# EAGLE schematic bms1 (EAGLE 9.6.2)
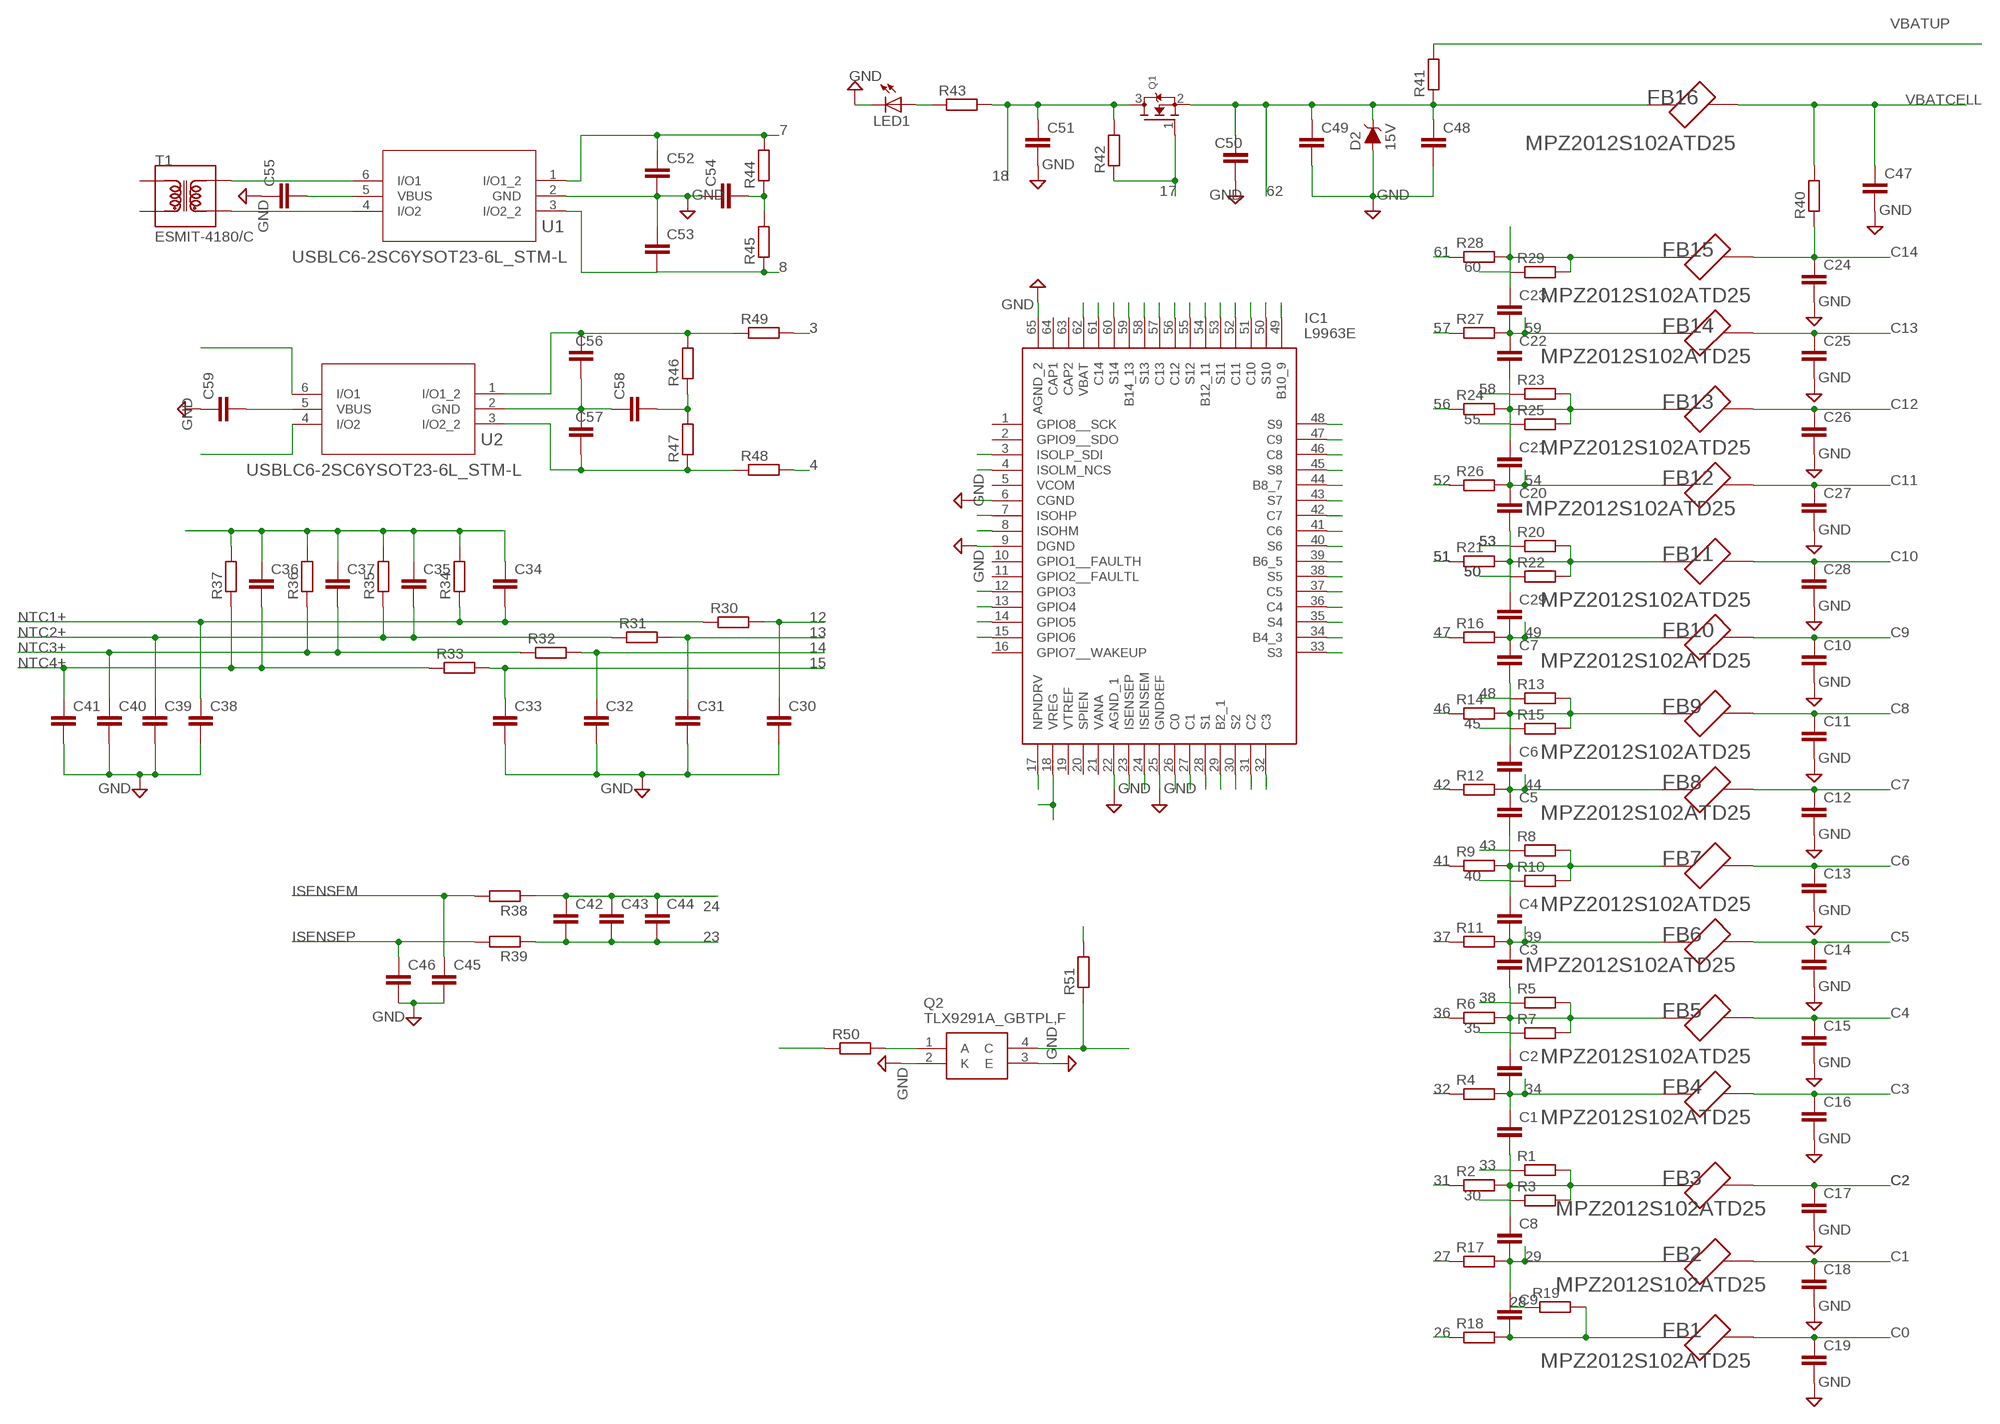
[diagram p0: schematic, sheet 1]

## Parts
C1  C-EUC0402K  [C0402K]
C2  C-EUC0402K  [C0402K]
C3  C-EUC0402K  [C0402K]
C4  C-EUC0402K  [C0402K]
C5  C-EUC0402K  [C0402K]
C6  C-EUC0402K  [C0402K]
C7  C-EUC0402K  [C0402K]
C8  C-EUC0402K  [C0402K]
C9  C-EUC0402K  [C0402K]
C10  C-EUC0402K  [C0402K]
C11  C-EUC0402K  [C0402K]
C12  C-EUC0402K  [C0402K]
C13  C-EUC0402K  [C0402K]
C14  C-EUC0402K  [C0402K]
C15  C-EUC0402K  [C0402K]
C16  C-EUC0402K  [C0402K]
C17  C-EUC0402K  [C0402K]
C18  C-EUC0402K  [C0402K]
C19  C-EUC0402K  [C0402K]
C20  C-EUC0402K  [C0402K]
C21  C-EUC0402K  [C0402K]
C22  C-EUC0402K  [C0402K]
C23  C-EUC0402K  [C0402K]
C24  C-EUC0402K  [C0402K]
C25  C-EUC0402K  [C0402K]
C26  C-EUC0402K  [C0402K]
C27  C-EUC0402K  [C0402K]
C28  C-EUC0402K  [C0402K]
C29  C-EUC0402K  [C0402K]
C30  C-EUC0402K  [C0402K]
C31  C-EUC0402K  [C0402K]
C32  C-EUC0402K  [C0402K]
C33  C-EUC0402K  [C0402K]
C34  C-EUC0402K  [C0402K]
C35  C-EUC0402K  [C0402K]
C36  C-EUC0402K  [C0402K]
C37  C-EUC0402K  [C0402K]
C38  C-EUC0402K  [C0402K]
C39  C-EUC0402K  [C0402K]
C40  C-EUC0402K  [C0402K]
C41  C-EUC0402K  [C0402K]
C42  C-EUC0402K  [C0402K]
C43  C-EUC0402K  [C0402K]
C44  C-EUC0402K  [C0402K]
C45  C-EUC0402K  [C0402K]
C46  C-EUC0402K  [C0402K]
C47  C-EUC0402K  [C0402K]
C48  C-EUC0402K  [C0402K]
C49  C-EUC0402K  [C0402K]
C50  C-EUC0402K  [C0402K]
C51  C-EUC0402K  [C0402K]
C52  C-EUC0402K  [C0402K]
C53  C-EUC0402K  [C0402K]
C54  C-EUC0402K  [C0402K]
C55  C-EUC0402K  [C0402K]
C56  C-EUC0402K  [C0402K]
C57  C-EUC0402K  [C0402K]
C58  C-EUC0402K  [C0402K]
C59  C-EUC0402K  [C0402K]
D2  15V  DIODE-ZENER-DZ2J150M0L  [PANASONIC_SMINI2-F5-B]
FB1  MPZ2012S102ATD25  [BEADC2012X105N]
FB2  MPZ2012S102ATD25  [BEADC2012X105N]
FB3  MPZ2012S102ATD25  [BEADC2012X105N]
FB4  MPZ2012S102ATD25  [BEADC2012X105N]
FB5  MPZ2012S102ATD25  [BEADC2012X105N]
FB6  MPZ2012S102ATD25  [BEADC2012X105N]
FB7  MPZ2012S102ATD25  [BEADC2012X105N]
FB8  MPZ2012S102ATD25  [BEADC2012X105N]
FB9  MPZ2012S102ATD25  [BEADC2012X105N]
FB10  MPZ2012S102ATD25  [BEADC2012X105N]
FB11  MPZ2012S102ATD25  [BEADC2012X105N]
FB12  MPZ2012S102ATD25  [BEADC2012X105N]
FB13  MPZ2012S102ATD25  [BEADC2012X105N]
FB14  MPZ2012S102ATD25  [BEADC2012X105N]
FB15  MPZ2012S102ATD25  [BEADC2012X105N]
FB16  MPZ2012S102ATD25  [BEADC2012X105N]
IC1  L9963E  [QFP50P1200X1200X120-65N]
LED1  LED  [SMARTLED-TTW]
Q1  MOSFET-NREFLOW  [SOT23]
Q2  TLX9291A_GBTPL,F  [SOIC127P700X230-4N]
R1  R-EU_R0603  [R0603]
R2  R-EU_R0603  [R0603]
R3  R-EU_R0603  [R0603]
R4  R-EU_R0603  [R0603]
R5  R-EU_R0603  [R0603]
R6  R-EU_R0603  [R0603]
R7  R-EU_R0603  [R0603]
R8  R-EU_R0603  [R0603]
R9  R-EU_R0603  [R0603]
R10  R-EU_R0603  [R0603]
R11  R-EU_R0603  [R0603]
R12  R-EU_R0603  [R0603]
R13  R-EU_R0603  [R0603]
R14  R-EU_R0603  [R0603]
R15  R-EU_R0603  [R0603]
R16  R-EU_R0603  [R0603]
R17  R-EU_R0603  [R0603]
R18  R-EU_R0603  [R0603]
R19  R-EU_R0603  [R0603]
R20  R-EU_R0603  [R0603]
R21  R-EU_R0603  [R0603]
R22  R-EU_R0603  [R0603]
R23  R-EU_R0603  [R0603]
R24  R-EU_R0603  [R0603]
R25  R-EU_R0603  [R0603]
R26  R-EU_R0603  [R0603]
R27  R-EU_R0603  [R0603]
R28  R-EU_R0603  [R0603]
R29  R-EU_R0603  [R0603]
R30  R-EU_R0603  [R0603]
R31  R-EU_R0603  [R0603]
R32  R-EU_R0603  [R0603]
R33  R-EU_R0603  [R0603]
R34  R-EU_R0603  [R0603]
R35  R-EU_R0603  [R0603]
R36  R-EU_R0603  [R0603]
R37  R-EU_R0603  [R0603]
R38  R-EU_R0603  [R0603]
R39  R-EU_R0603  [R0603]
R40  R-EU_R0603  [R0603]
R41  R-EU_R0603  [R0603]
R42  R-EU_R0603  [R0603]
R43  R-EU_R0603  [R0603]
R44  R-EU_R0603  [R0603]
R45  R-EU_R0603  [R0603]
R46  R-EU_R0603  [R0603]
R47  R-EU_R0603  [R0603]
R48  R-EU_R0603  [R0603]
R49  R-EU_R0603  [R0603]
R50  R-EU_M0805  [M0805]
R51  R-EU_M0805  [M0805]
T1  ESMIT-4180/C  [XFMR_ESMIT-4180/C]
U1  USBLC6-2SC6YSOT23-6L_STM-L  [SOT23-6L_STM-L]
U2  USBLC6-2SC6YSOT23-6L_STM-L  [SOT23-6L_STM-L]

## Nets
3: IC1.3(ISOLP_SDI) R49.2
4: IC1.4(ISOLM_NCS) R48.2
7: C52.1 IC1.7(ISOHP) R44.2 U1.1(I/O1_2)
8: C53.2 IC1.8(ISOHM) R45.1 U1.3(I/O2_2)
12: C30.1 IC1.12(GPIO3) R30.2
13: C31.1 IC1.13(GPIO4) R31.2
14: C32.1 IC1.14(GPIO5) R32.2
15: C33.1 IC1.15(GPIO6) R33.2
17: IC1.17(NPNDRV) Q1.1(G) R42.1
18: C51.1 Q1.3(D) R42.2 R43.2
23: C42.2 C43.2 C44.2 IC1.23(ISENSEP) R39.1
24: C42.1 C43.1 C44.1 IC1.24(ISENSEM) R38.1
26: IC1.26(C0) R18.1
27: IC1.27(C1) R17.1
28: IC1.28(S1) R19.1
29: C8.2 C9.1 FB2.1 IC1.29(B2_1) R17.2
30: IC1.30(S2) R3.1
31: IC1.31(C2) R2.1
32: IC1.32(C3) R4.1
33: IC1.33(S3) R1.1
34: C1.1 C2.2 C9.2 FB1.1 FB4.1 IC1.34(B4_3) R4.2 R18.2 R19.2
35: IC1.35(S4) R7.1
36: IC1.36(C4) R6.1
37: IC1.37(C5) R11.1
38: IC1.38(S5) R5.1
39: C3.1 C4.2 FB6.1 IC1.39(B6_5) R11.2
40: IC1.40(S6) R10.1
41: IC1.41(C6) R9.1
42: IC1.42(C7) R12.1
43: IC1.43(S7) R8.1
44: C5.1 C6.2 FB8.1 IC1.44(B8_7) R12.2
45: IC1.45(S8) R15.1
46: IC1.46(C8) R14.1
47: IC1.47(C9) R16.1
48: IC1.48(S9) R13.1
49: C7.1 C29.2 FB10.1 IC1.49(B10_9) R16.2
50: IC1.50(S10) R22.1
51: IC1.51(C10) R21.1
52: IC1.52(C11) R26.1
53: IC1.53(S11) R20.1
54: C20.1 C21.2 FB12.1 IC1.54(B12_11) R26.2
55: IC1.55(S12) R25.1
56: IC1.56(C12) R24.1
57: IC1.57(C13) R27.1
58: IC1.58(S13) R23.1
59: C22.1 C23.2 FB14.1 IC1.59(B14_13) R27.2
60: IC1.60(S14) R29.1
61: IC1.61(C14) R28.1
62: C48.1 C49.1 C50.1 D2.C FB16.1 IC1.62(VBAT) Q1.2(S) R41.1
C0: C19.1 FB1.2
C1: C18.1 FB2.2
C2: C17.1 FB3.2
C3: C16.1 FB4.2
C4: C15.1 FB5.2
C5: C14.1 FB6.2
C6: C13.1 FB7.2
C7: C12.1 FB8.2
C8: C11.1 FB9.2
C9: C10.1 FB10.2
C10: C28.1 FB11.2
C11: C27.1 FB12.2
C12: C26.1 FB13.2
C13: C25.1 FB14.2
C14: C24.1 FB15.2 R40.1
GND: C10.2 C11.2 C12.2 C13.2 C14.2 C15.2 C16.2 C17.2 C18.2 C19.2 C24.2 C25.2 C26.2 C27.2 C28.2 C30.2 C31.2 C32.2 C33.2 C38.2 C39.2 C40.2 C41.2 C45.2 C46.2 C47.2 C48.2 C49.2 C50.2 C51.2 C52.2 C53.1 C54.1 C55.1 C59.1 D2.A IC1.6(CGND) IC1.9(DGND) IC1.22(AGND_1) IC1.25(GNDREF) IC1.65(AGND_2) LED1.C@1(C) Q2.2(K) Q2.3(E) U1.2(GND)
ISENSEM: C45.1 R38.2
ISENSEP: C46.1 R39.2
N$1: C2.1 C3.2 FB5.1 R5.2 R6.2 R7.2
N$2: C1.2 C8.1 FB3.1 R1.2 R2.2 R3.2
N$3: C4.1 C5.2 FB7.1 R8.2 R9.2 R10.2
N$4: C6.1 C7.2 FB9.1 R13.2 R14.2 R15.2
N$5: C20.2 C29.1 FB11.1 R20.2 R21.2 R22.2
N$6: C21.1 C22.2 FB13.1 R23.2 R24.2 R25.2
N$7: C23.1 FB15.1 R28.2 R29.2
N$8: IC1.18(VREG)
N$9: Q2.1(A) R50.2
N$10: Q2.4(C) R51.1
N$11: C54.2 R44.1 R45.2
N$12: LED1.A@1(A) R43.1
N$13: C56.1 R46.2 R49.1 U2.1(I/O1_2)
N$14: T1.3 U1.6(I/O1)
N$15: T1.4 U1.4(I/O2)
N$16: C55.2 U1.5(VBUS)
N$17: C34.1 C35.1 C36.1 C37.1 R34.2 R35.2 R36.2 R37.2
N$18: C57.2 R47.1 R48.1 U2.3(I/O2_2)
N$19: C58.2 R46.1 R47.2
N$20: C56.2 C57.1 C58.1 U2.2(GND)
N$21: C59.2 U2.5(VBUS)
N$22: U2.6(I/O1)
N$23: U2.4(I/O2)
N$24: R50.1
N$25: R51.2
NTC1+: C34.2 C38.1 R30.1 R34.1
NTC2+: C35.2 C39.1 R31.1 R35.1
NTC3+: C37.2 C40.1 R32.1 R36.1
NTC4+: C36.2 C41.1 R33.1 R37.1
VBATCELL: C47.1 FB16.2 R40.2
VBATUP: R41.2
Unconnected: IC1.1(GPIO8__SCK) IC1.2(GPIO9__SDO) IC1.5(VCOM) IC1.10(GPIO1__FAULTH) IC1.11(GPIO2__FAULTL) IC1.16(GPIO7__WAKEUP) IC1.19(VTREF) IC1.20(SPIEN) IC1.21(VANA) IC1.63(CAP2) IC1.64(CAP1) T1.1 T1.2

## Library data of the parts
C1-C59 = rcl:C-EU: CAPACITOR, European symbol; SPICEPREFIX: C
D2 = SparkFun-DiscreteSemi:DIODE-ZENER: Zener Diode A Zener diode allows current to flow from its anode to its cathode like a normal semiconductor diode, but it also permits current to flow in the reverse direction when its "Zener voltage" is reached. - WIkipedia; PROD_ID: DIO-12989
FB1-FB16 = MPZ2012S102ATD25:MPZ2012S102ATD25: Check prices <https://pricing.snapeda.com/parts/MPZ2012S102ATD25/TDK/view-part?ref=eda>; AVAILABILITY: In Stock; DESCRIPTION: 1 kOhms @ 100 MHz 1 Power Line Ferrite Bead 0805 (2012 Metric) 1.5A 150mOhm; MF: TDK; MP: MPZ2012S102ATD25; PACKAGE: 0805 TDK; PRICE: None; PURCHASE-URL: https://pricing.snapeda.com/search/part/MPZ2012S102ATD25/?ref=eda
IC1 = L9963E:L9963E: Battery Management Automotive chip for battery management applications daisy chain up to 31 devices Source: Datasheet <https://www.st.com/resource/en/datasheet/l9963e.pdf>; ARROW_PART_NUMBER: L9963E; ARROW_PRICE-STOCK: https://www.arrow.com/en/products/l9963e/stmicroelectronics?region=nac; DESCRIPTION: Battery Management Automotive chip for battery management applications daisy chain up to 31 devices; HEIGHT: 1.2mm; MANUFACTURER_NAME: STMicroelectronics; MANUFACTURER_PART_NUMBER: L9963E; MOUSER_PART_NUMBER: 511-L9963E; MOUSER_PRICE-STOCK: https://www.mouser.co.uk/ProductDetail/STMicroelectronics/L9963E?qs=CiayqK2gdcLHuPZfXyysMw%3D%3D
LED1 = adafruit:LED: LED OSRAM: - CHIPLED LG R971, LG N971, LY N971, LG Q971, LY Q971, LO R971, LY R971 LH N974, LH R974 LS Q976, LO Q976, LY Q976 LO Q996 - Hyper CHIPLED LW Q18S LB Q993, LB Q99A, LB R99A - SideLED LS A670, LO A670, LY A670, LG A670, LP A670 LB A673, LV A673, LT A673, LW A673 LH A674 LY A675 LS A676, LA A676, LO A676, LY A676, LW A676 LS A679, LY A679, LG A679 - Hyper Micro SIDELED® LS Y876, LA Y876, LO Y876, LY Y876 LT Y87S - SmartLED LW L88C, LW L88S LB L89C, LB L89S, LG L890 LS L89K, LO L89K, LY L89K LS L896, LA L896, LO L896, LY L896 - TOPLED LS T670, LO T670, LY T670, LG T670, LP T670 LSG T670, LSP T670, LSY T670, LOP T670, LYG T670 LG T671, LOG T671, LSG T671 LB T673, LV T673, LT T673, LW T673 LH T674 LS T676, LA T676, LO T676, LY T676, LB T676, LH T676, LSB T676, LW T676 LB T67C, LV T67C, LT T67C, LS T67K, LO T67K, LY T67K, LW E67C LS E67B, LA E67B, LO E67B, LY E67B, LB E67C, LV E67C, LT E67C LW T67C LS T679, LY T679, LG T679 LS T770, LO T770, LY T770, LG T770, LP T770 LB T773, LV T773, LT T773, LW T773 LH T774 LS E675, LA E675, LY E675, LS T675 LS T776, LA T776, LO T776, LY T776, LB T776 LHGB T686 LT T68C, LB T68C - Hyper Mini TOPLED® LB M676 - Mini TOPLED Santana® LG M470 LS M47K, LO M47K, LY M47K Source: http://www.osram.convergy.de/
Q1 = adafruit:MOSFET-N: N-Channel Mosfet 2N7002E - 60V 260mA SOT23 [Digikey: 2N7002ET1GOSTR-ND] - REEL BSH103 - 30V 850mA SOT23 [Digikey: 568-5013-1-ND]
Q2 = SamacSys_Parts:TLX9291A_GBTPL,F: Transistor Output Optocouplers Transistor Coupler Automotive; AEC-Q101 Source: Datasheet <https://toshiba.semicon-storage.com/info/docget.jsp?did=53137&prodName=TLX9291A>; DESCRIPTION: Transistor Output Optocouplers Transistor Coupler Automotive; AEC-Q101; HEIGHT: 2.3mm; MANUFACTURER_NAME: Toshiba; MANUFACTURER_PART_NUMBER: TLX9291A(GBTPL,F; MOUSER_PART_NUMBER: 757-TLX9291AGBTPLF; MOUSER_PRICE-STOCK: https://www.mouser.co.uk/ProductDetail/Toshiba/TLX9291AGBTPLF?qs=YwPsRIUVAOcOvZScDNZO1w%3D%3D
R1-R51 = rcl:R-EU_: RESISTOR, European symbol; SPICEPREFIX: R
T1 = ESMIT-4180_C:ESMIT-4180/C: Audio Transformer, 3750 Vrms Isolation, DC Resistance Primary-Secondary 250 mOhm, SMT Check prices <https://pricing.snapeda.com/parts/ESMIT-4180/C/Sumida%20America/view-part?ref=eda>; AVAILABILITY: In Stock; DESCRIPTION: - Impedance Primary Ohms - Impedance Secondary Ohms - Audio Transformer - Surface Mount; MF: Sumida America; MP: ESMIT-4180/C; PACKAGE: 0805 Sumida; PRICE: None; PURCHASE-URL: https://pricing.snapeda.com/search/part/ESMIT-4180/C/?ref=eda
U1 U2 = USBLC6-2SC6Y:USBLC6-2SC6Y; COPYRIGHT: Copyright (C) 2021 Ultra Librarian. All rights reserved.; MANUFACTURER_PART_NUMBER: USBLC6-2SC6Y; MFR_NAME: STMicroelectronics